# EAGLE schematic winderController (EAGLE 9.2.2)
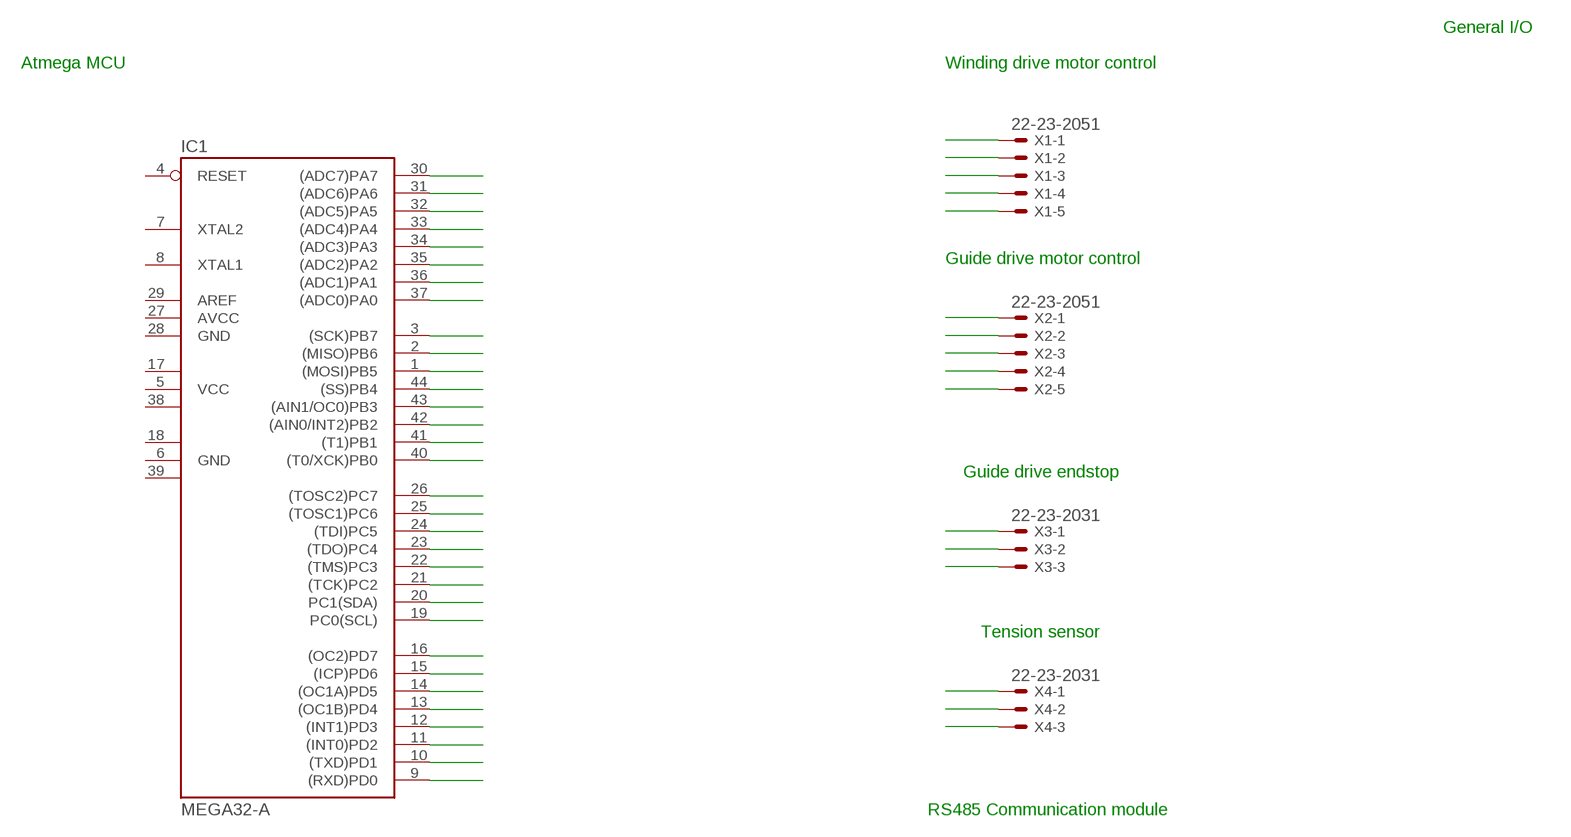
[diagram p0: schematic, sheet 1]

## Parts
IC1  MEGA32-A  [TQFP44]
X1  22-23-2051  [22-23-2051]
X2  22-23-2051  [22-23-2051]
X3  22-23-2031  [22-23-2031]
X4  22-23-2031  [22-23-2031]

## Nets
N$1: IC1.30((ADC7)PA7)
N$2: IC1.31((ADC6)PA6)
N$3: IC1.32((ADC5)PA5)
N$4: IC1.33((ADC4)PA4)
N$5: IC1.34((ADC3)PA3)
N$6: IC1.35((ADC2)PA2)
N$7: IC1.36((ADC1)PA1)
N$8: IC1.37((ADC0)PA0)
N$9: IC1.3((SCK)PB7)
N$10: IC1.2((MISO)PB6)
N$11: IC1.1((MOSI)PB5)
N$12: IC1.44((SS)PB4)
N$13: IC1.43((AIN1/OC0)PB3)
N$14: IC1.42((AIN0/INT2)PB2)
N$15: IC1.41((T1)PB1)
N$16: IC1.40((T0/XCK)PB0)
N$17: IC1.26((TOSC2)PC7)
N$18: IC1.25((TOSC1)PC6)
N$19: IC1.24((TDI)PC5)
N$20: IC1.23((TDO)PC4)
N$21: IC1.22((TMS)PC3)
N$22: IC1.21((TCK)PC2)
N$23: IC1.20(PC1(SDA))
N$24: IC1.19(PC0(SCL))
N$25: IC1.16((OC2)PD7)
N$26: IC1.15((ICP)PD6)
N$27: IC1.14((OC1A)PD5)
N$28: IC1.13((OC1B)PD4)
N$29: IC1.12((INT1)PD3)
N$30: IC1.11((INT0)PD2)
N$31: IC1.10((TXD)PD1)
N$32: IC1.9((RXD)PD0)
N$33: X1.1
N$34: X1.2
N$35: X1.3
N$36: X1.4
N$37: X1.5
N$38: X2.1
N$39: X2.2
N$40: X2.3
N$41: X2.4
N$42: X2.5
N$43: X3.1
N$44: X3.2
N$45: X3.3
N$46: X4.1
N$47: X4.2
N$48: X4.3
Unconnected: IC1.4(RESET) IC1.7(XTAL2) IC1.8(XTAL1) IC1.29(AREF)

## Notes on the sheet
- General I/O
- Atmega MCU | Winding drive motor control
- Guide drive motor control
- Guide drive endstop
- Tension sensor
- RS485 Communication module

## Power pins joined to a net without a drawn wire
AVCC: IC1.27(AVCC)
GND: IC1.6(GND) IC1.28(GND)
GND1: IC1.18(GND1)
GND2: IC1.39(GND2)
VCC: IC1.5(VCC)
VCC1: IC1.17(VCC1)
VCC2: IC1.38(VCC2)

## Library data of the parts
IC1 = atmel:MEGA32: MICROCONTROLLER 32 Kbytes FLASH 2 Kbytes SRAM 1 Kbytes EEPROM USART 8-channel 10 bit ADC Source: www.atmel.com .. doc2503.pdf; MPN: ATMEGA32-16AU; OC_FARNELL: 9171274; OC_NEWARK: 69K6677
X1 X2 = con-molex:22-23-2051: .100" (2.54mm) Center Header - 5 Pin; MF: MOLEX; MPN: 22-23-2051; OC_FARNELL: 1462952; OC_NEWARK: 38C9178
X3 X4 = con-molex:22-23-2031: .100" (2.54mm) Center Header - 3 Pin; MF: MOLEX; MPN: 22-23-2031; OC_FARNELL: 1462950; OC_NEWARK: 30C0862